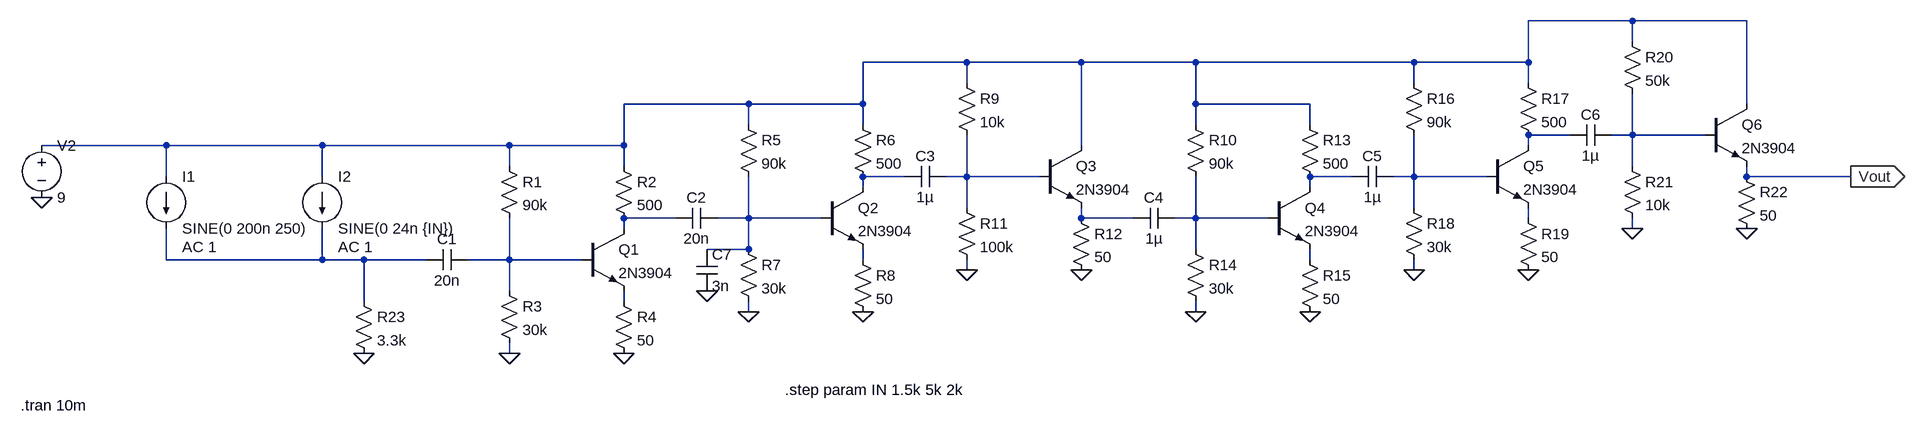
[diagram p0: schematic Four_Stage_Amplifier.asc]
Four_Stage_Amplifier.asc, the LTspice schematic file:
Version 4
SHEET 1 2352 680
WIRE 1904 -256 1744 -256
WIRE 2080 -256 1904 -256
WIRE 1904 -224 1904 -256
WIRE 880 -192 720 -192
WIRE 1056 -192 880 -192
WIRE 1232 -192 1056 -192
WIRE 1568 -192 1232 -192
WIRE 1744 -192 1744 -256
WIRE 1744 -192 1568 -192
WIRE 880 -160 880 -192
WIRE 1568 -160 1568 -192
WIRE 1744 -160 1744 -192
WIRE 544 -128 352 -128
WIRE 720 -128 720 -192
WIRE 720 -128 544 -128
WIRE 1232 -128 1232 -192
WIRE 1408 -128 1232 -128
WIRE 2080 -128 2080 -256
WIRE 544 -96 544 -128
WIRE 720 -96 720 -128
WIRE 1232 -96 1232 -128
WIRE 1408 -96 1408 -128
WIRE 1808 -80 1744 -80
WIRE 1904 -80 1904 -144
WIRE 1904 -80 1872 -80
WIRE 2016 -80 1904 -80
WIRE -352 -64 -544 -64
WIRE -112 -64 -352 -64
WIRE 176 -64 -112 -64
WIRE 352 -64 352 -128
WIRE 352 -64 176 -64
WIRE 1056 -64 1056 -192
WIRE 1744 -64 1744 -80
WIRE 176 -32 176 -64
WIRE 352 -32 352 -64
WIRE 1904 -32 1904 -80
WIRE -352 -16 -352 -64
WIRE -112 -16 -112 -64
WIRE 784 -16 720 -16
WIRE 880 -16 880 -80
WIRE 880 -16 848 -16
WIRE 992 -16 880 -16
WIRE 1472 -16 1408 -16
WIRE 1568 -16 1568 -80
WIRE 1568 -16 1536 -16
WIRE 1680 -16 1568 -16
WIRE 2080 -16 2080 -32
WIRE 2240 -16 2080 -16
WIRE 720 0 720 -16
WIRE 1408 0 1408 -16
WIRE 880 32 880 -16
WIRE 1568 32 1568 -16
WIRE 432 48 352 48
WIRE 544 48 544 -16
WIRE 544 48 496 48
WIRE 656 48 544 48
WIRE 1056 48 1056 32
WIRE 1136 48 1056 48
WIRE 1232 48 1232 -16
WIRE 1232 48 1200 48
WIRE 1344 48 1232 48
WIRE 1744 48 1744 32
WIRE 352 64 352 48
WIRE 1904 64 1904 48
WIRE 544 96 544 48
WIRE 544 96 480 96
WIRE 1232 96 1232 48
WIRE -352 112 -352 64
WIRE -112 112 -112 64
WIRE -112 112 -352 112
WIRE -48 112 -112 112
WIRE 48 112 -48 112
WIRE 176 112 176 48
WIRE 176 112 112 112
WIRE 288 112 176 112
WIRE 720 112 720 96
WIRE 1408 112 1408 96
WIRE 880 128 880 112
WIRE 1568 128 1568 112
WIRE 176 160 176 112
WIRE -48 176 -48 112
WIRE 352 176 352 160
WIRE 544 192 544 176
WIRE 1232 192 1232 176
WIRE 176 256 176 240
FLAG -544 16 0
FLAG 176 256 0
FLAG 352 256 0
FLAG 544 192 0
FLAG 720 192 0
FLAG 880 128 0
FLAG 1056 128 0
FLAG 1232 192 0
FLAG 1408 192 0
FLAG 1568 128 0
FLAG 1744 128 0
FLAG 1904 64 0
FLAG 2080 64 0
FLAG 2240 -16 Vout
IOPIN 2240 -16 Out
FLAG -48 256 0
FLAG 480 160 0
SYMBOL voltage -544 -80 R0
WINDOW 123 0 0 Left 2
WINDOW 39 0 0 Left 2
SYMATTR InstName V2
SYMATTR Value 9
SYMBOL npn 288 64 R0
SYMATTR InstName Q1
SYMATTR Value 2N3904
SYMBOL cap 112 96 R90
WINDOW 0 0 32 VBottom 2
WINDOW 3 32 32 VTop 2
SYMATTR InstName C1
SYMATTR Value 20n
SYMBOL res 160 -48 R0
SYMATTR InstName R1
SYMATTR Value 90k
SYMBOL res 336 -48 R0
SYMATTR InstName R2
SYMATTR Value 500
SYMBOL res 160 144 R0
SYMATTR InstName R3
SYMATTR Value 30k
SYMBOL res 336 160 R0
SYMATTR InstName R4
SYMATTR Value 50
SYMBOL npn 656 0 R0
SYMATTR InstName Q2
SYMATTR Value 2N3904
SYMBOL res 528 -112 R0
SYMATTR InstName R5
SYMATTR Value 90k
SYMBOL res 704 -112 R0
SYMATTR InstName R6
SYMATTR Value 500
SYMBOL res 528 80 R0
SYMATTR InstName R7
SYMATTR Value 30k
SYMBOL res 704 96 R0
SYMATTR InstName R8
SYMATTR Value 50
SYMBOL npn 992 -64 R0
SYMATTR InstName Q3
SYMATTR Value 2N3904
SYMBOL res 864 -176 R0
SYMATTR InstName R9
SYMATTR Value 10k
SYMBOL res 864 16 R0
SYMATTR InstName R11
SYMATTR Value 100k
SYMBOL res 1040 32 R0
SYMATTR InstName R12
SYMATTR Value 50
SYMBOL cap 496 32 R90
WINDOW 0 0 32 VBottom 2
WINDOW 3 32 32 VTop 2
SYMATTR InstName C2
SYMATTR Value 20n
SYMBOL cap 848 -32 R90
WINDOW 0 0 32 VBottom 2
WINDOW 3 32 32 VTop 2
SYMATTR InstName C3
SYMATTR Value 1µ
SYMBOL npn 1344 0 R0
SYMATTR InstName Q4
SYMATTR Value 2N3904
SYMBOL res 1216 -112 R0
SYMATTR InstName R10
SYMATTR Value 90k
SYMBOL res 1392 -112 R0
SYMATTR InstName R13
SYMATTR Value 500
SYMBOL res 1216 80 R0
SYMATTR InstName R14
SYMATTR Value 30k
SYMBOL res 1392 96 R0
SYMATTR InstName R15
SYMATTR Value 50
SYMBOL cap 1200 32 R90
WINDOW 0 0 32 VBottom 2
WINDOW 3 32 32 VTop 2
SYMATTR InstName C4
SYMATTR Value 1µ
SYMBOL npn 1680 -64 R0
SYMATTR InstName Q5
SYMATTR Value 2N3904
SYMBOL res 1552 -176 R0
SYMATTR InstName R16
SYMATTR Value 90k
SYMBOL res 1728 -176 R0
SYMATTR InstName R17
SYMATTR Value 500
SYMBOL res 1552 16 R0
SYMATTR InstName R18
SYMATTR Value 30k
SYMBOL res 1728 32 R0
SYMATTR InstName R19
SYMATTR Value 50
SYMBOL cap 1536 -32 R90
WINDOW 0 0 32 VBottom 2
WINDOW 3 32 32 VTop 2
SYMATTR InstName C5
SYMATTR Value 1µ
SYMBOL npn 2016 -128 R0
SYMATTR InstName Q6
SYMATTR Value 2N3904
SYMBOL res 1888 -240 R0
SYMATTR InstName R20
SYMATTR Value 50k
SYMBOL res 1888 -48 R0
SYMATTR InstName R21
SYMATTR Value 10k
SYMBOL res 2064 -32 R0
SYMATTR InstName R22
SYMATTR Value 50
SYMBOL cap 1872 -96 R90
WINDOW 0 0 32 VBottom 2
WINDOW 3 32 32 VTop 2
SYMATTR InstName C6
SYMATTR Value 1µ
SYMBOL res -64 160 R0
SYMATTR InstName R23
SYMATTR Value 3.3k
SYMBOL current -352 -16 R0
WINDOW 123 24 108 Left 2
WINDOW 39 0 0 Left 2
SYMATTR Value2 AC 1
SYMATTR InstName I1
SYMATTR Value SINE(0 200n 250)
SYMBOL current -112 -16 R0
WINDOW 123 24 108 Left 2
WINDOW 39 0 0 Left 2
SYMATTR Value2 AC 1
SYMATTR InstName I2
SYMATTR Value SINE(0 24n {IN})
SYMBOL cap 464 96 R0
SYMATTR InstName C7
SYMATTR Value 3n
TEXT 600 312 Left 2 !.step param IN 1.5k 5k 2k
TEXT -576 336 Left 2 !.tran 10m

The netlist it stands for:
* Four_Stage_Amplifier.asc
V2 N001 0 9
Q1 N008 N014 N017 0 2N3904
C1 N014 N013 20n
R1 N001 N014 90k
R2 N001 N008 500
R3 N014 0 30k
R4 N017 0 50
Q2 N004 N009 N015 0 2N3904
R5 N001 N009 90k
R6 N001 N004 500
R7 N009 0 30k
R8 N015 0 50
Q3 N001 N005 N010 0 2N3904
R9 N001 N005 10k
R11 N005 0 100k
R12 N010 0 50
C2 N009 N008 20n
C3 N005 N004 1µ
Q4 N006 N011 N016 0 2N3904
R10 N001 N011 90k
R13 N001 N006 500
R14 N011 0 30k
R15 N016 0 50
C4 N011 N010 1µ
Q5 N002 N007 N012 0 2N3904
R16 N001 N007 90k
R17 N001 N002 500
R18 N007 0 30k
R19 N012 0 50
C5 N007 N006 1µ
Q6 N001 N003 Vout 0 2N3904
R20 N001 N003 50k
R21 N003 0 10k
R22 Vout 0 50
C6 N003 N002 1µ
R23 N013 0 3.3k
I1 N001 N013 SINE(0 200n 250) AC 1
I2 N001 N013 SINE(0 24n {IN}) AC 1
C7 N009 0 3n
.model NPN NPN
.model PNP PNP
.lib standard.bjt
.step param IN 1.5k 5k 2k
.tran 10m
.backanno
.end